# EAGLE design psiboard (EAGLE 9.1.1)
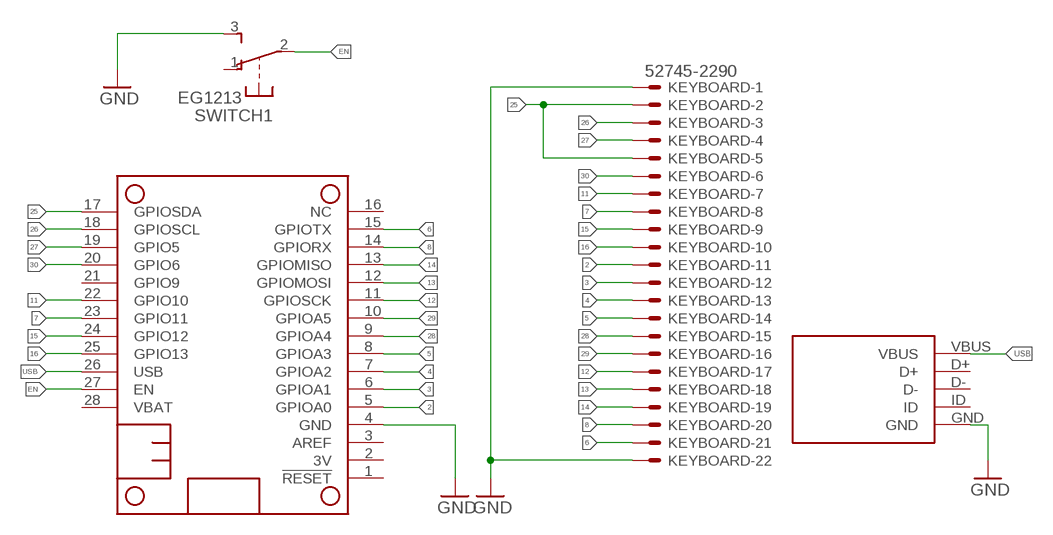
[diagram p0: schematic, sheet 1]

## Parts
FEATHER  FEATHERWING_NODIM  [FEATHERWING_DIM]
KEYBOARD  52745-2290  [52745-2290]
SWITCH  EG1213  [EG1213]
U$2  USB_MICRO_PWR  [MICROBUILDER_4UCONN_20329]

## Nets
2: FEATHER.5(GPIOA0) KEYBOARD.11
3: FEATHER.6(GPIOA1) KEYBOARD.12
4: FEATHER.7(GPIOA2) KEYBOARD.13
5: FEATHER.8(GPIOA3) KEYBOARD.14
6: FEATHER.15(GPIOTX) KEYBOARD.21
7: FEATHER.23(GPIO11) KEYBOARD.8
8: FEATHER.14(GPIORX) KEYBOARD.20
11: FEATHER.22(GPIO10) KEYBOARD.7
12: FEATHER.11(GPIOSCK) KEYBOARD.17
13: FEATHER.12(GPIOMOSI) KEYBOARD.18
14: FEATHER.13(GPIOMISO) KEYBOARD.19
15: FEATHER.24(GPIO12) KEYBOARD.9
16: FEATHER.25(GPIO13) KEYBOARD.10
25: FEATHER.17(GPIOSDA) KEYBOARD.2 KEYBOARD.5
26: FEATHER.18(GPIOSCL) KEYBOARD.3
27: FEATHER.19(GPIO5) KEYBOARD.4
28: FEATHER.9(GPIOA4) KEYBOARD.15
29: FEATHER.10(GPIOA5) KEYBOARD.16
30: FEATHER.20(GPIO6) KEYBOARD.6
EN: FEATHER.27(EN) SWITCH.2(1:P)
GND: FEATHER.4(GND) KEYBOARD.1 KEYBOARD.22 SWITCH.3(1:S) U$2.GND
USB: FEATHER.26(USB) U$2.VBUS
Unconnected: FEATHER.1(!RESET) FEATHER.2(3V) FEATHER.3(AREF) FEATHER.16(NC) FEATHER.21(GPIO9) FEATHER.28(VBAT) SWITCH.1(1:O) SWITCH.MT1(MT) SWITCH.MT2(MT) U$2.D+ U$2.D- U$2.ID

## Library data of the parts
FEATHER = adafruit:FEATHERWING
KEYBOARD = con-molex:52745-2290: FFC/FPC-to-Board 0.50mm (.020") SMT Top Contact Right Angle, ZIF, Style Receptacle 52745 / 52435 Source: http://www.molex.com/product/ffc/52745.html; MF: MOLEX; OC_FARNELL: unknown; OC_NEWARK: unknown
SWITCH = adafruit:EG1213: E-Switch right-angle slide SPDT Part #EG1213 http://www.ladyada.net/library/eagle
U$2 = microB:USB_MICRO_PWR

## Board
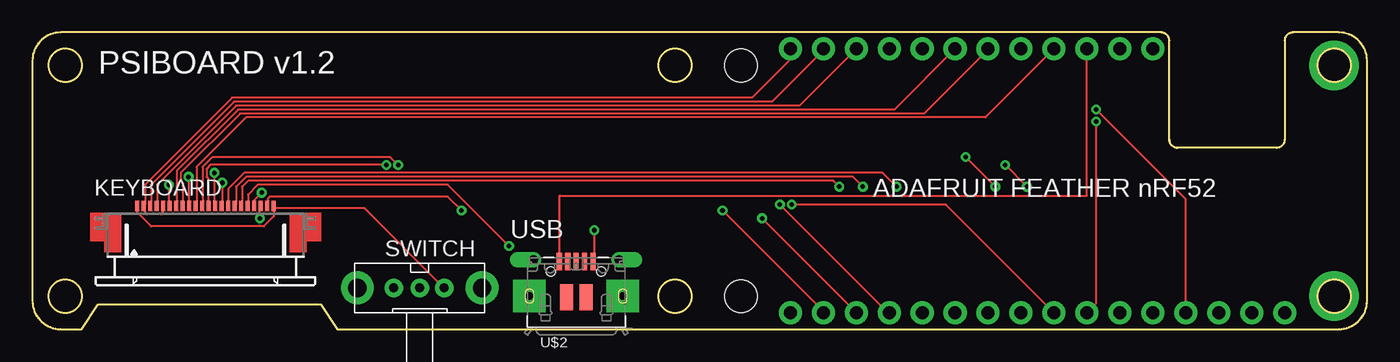
[diagram p1: board, top side]
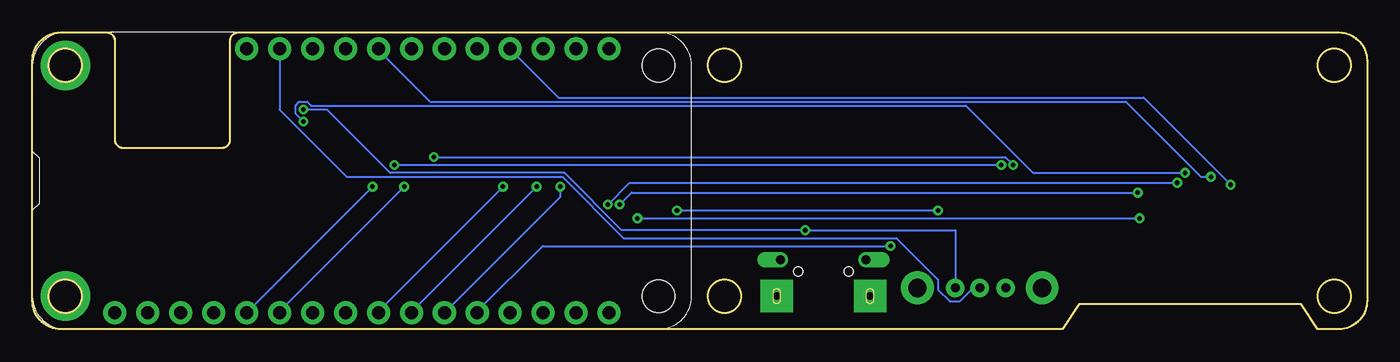
[diagram p2: board, bottom side, seen from below]

Size 102.87 x 22.86 mm. Coordinates in mm from the lower left corner, seen from the top.
Outline: 0,20.69 0,2.17 arc90 2.17,0 3.81,0 5.08,1.91 22.23,1.91 23.5,0 100.7,0 arc90 102.87,2.17 102.87,20.69 arc90 100.7,22.86 97.16,22.86 arc90 96.52,22.23 96.52,14.61 arc-90 95.89,13.97 88.27,13.97 arc-90 87.63,14.61 87.63,22.23 arc90 87,22.86 2.17,22.86 arc90 0,20.69
Outline: circle at 2.54,20.32 radius 1.27
Outline: circle at 2.54,2.54 radius 1.27
Outline: circle at 49.53,20.32 radius 1.27
Outline: circle at 49.53,2.54 radius 1.27
Outline: circle at 100.33,20.32 radius 1.27
Outline: circle at 100.33,2.54 radius 1.27
Copper layers (1*16): Top 0.035mm / dielectric 1.5mm / Bottom 0.035mm
Design rules "default": minimum track width 6mil, minimum drill 0.35mm, track to track 6mil, track to pad 6mil, pad to pad 6mil, via to via 6mil, smd to smd 6mil, copper to edge 40mil, drill to drill 6mil, minimum pad ring 10mil, minimum via ring 8mil, stop-mask expansion 4mil, vias tented up to drill 0mil, thermal gap 10mil
Holes 2.54 mm at 2.54,2.54 2.54,20.32 49.53,2.54 49.53,20.32

### Footprints (pad centres in the part's own frame; a part is rotated, then mirrored left to right if it is on the bottom)
FEATHERWING_DIM = drill 1 pad 1.778: 1 6.35,1.27; 2 8.89,1.27; 3 11.43,1.27; 4 13.97,1.27; 5 16.51,1.27; 6 19.05,1.27; 7 21.59,1.27; 8 24.13,1.27; 9 26.67,1.27; 10 29.21,1.27; 11 31.75,1.27; 12 34.29,1.27; 13 36.83,1.27; 14 39.37,1.27; 15 41.91,1.27; 16 44.45,1.27; 17 44.45,21.59; 18 41.91,21.59; 19 39.37,21.59; 20 36.83,21.59; 21 34.29,21.59; 22 31.75,21.59; 23 29.21,21.59; 24 26.67,21.59; 25 24.13,21.59; 26 21.59,21.59; 27 19.05,21.59; 28 16.51,21.59 | drill 2.5 pad 3.81: P$1 2.54,20.32; P$2 2.54,2.54 | hole 2.54: 48.26,20.32; 48.26,2.54
52745-2290 = smd 0.3 x 0.8: 1 -5.25,2.5; 2 -4.75,2.5; 3 -4.25,2.5; 4 -3.75,2.5; 5 -3.25,2.5; 6 -2.75,2.5; 7 -2.25,2.5; 8 -1.75,2.5; 9 -1.25,2.5; 10 -0.75,2.5; 11 -0.25,2.5; 12 0.25,2.5; 13 0.75,2.5; 14 1.25,2.5; 15 1.75,2.5; 16 2.25,2.5; 17 2.75,2.5; 18 3.25,2.5; 19 3.75,2.5; 20 4.25,2.5; 21 4.75,2.5; 22 5.25,2.5
EG1213 = drill 0.7 pad 1.422: 1 -2,0; 2 0,0; 3 1.9,0 | drill 1.4 pad 2.54: MT1 -4.8,0; MT2 4.8,0
MICROBUILDER_4UCONN_20329 = smd 1 x 2: BASE@1 -0.75,-2; BASE@2 0.75,-2 | smd 0.4 x 1.35: D+ 0,0.775; D- -0.65,0.775; GND 1.3,0.775; ID 0.65,0.775; VBUS -1.3,0.775 | drill 0.7 offset: SPRT@1 -3.3,0.9; SPRT@2 3.3,0.9 | drill 0.6 pad 2.5 square: SPRT@3 -3.6,-1.9; SPRT@4 3.6,-1.9 | hole 0.7: -1.95,0; 1.95,0

### Placement (x,y rotation side)
FEATHER  102.87,0 0 bottom
KEYBOARD  13.34,6.99 0 top
SWITCH  29.84,3.17 0 top
U$2  41.91,4.45 0 top

### Tracks (layer width: path | path; a pad name or v marks a point on that pad's centre or on a via)
2  (via drill 0.35)
  Top 0.152: v28.19,12.65 27.58,13.26 13.87,13.26 13.11,12.5 13.11,9.6 KEYBOARD.11 | v76.66,10.97 v74.98,12.65
  Bottom 0.152: v74.98,12.65 v28.19,12.65 | FEATHER.5 v76.66,10.97
3  (via drill 0.35)
  Top 0.152: v27.28,12.65 13.72,12.65 13.41,12.34 13.41,11.73 13.56,11.58 13.56,9.6 KEYBOARD.12 | v74.22,10.97 v71.93,13.26
  Bottom 0.152: v27.28,12.65 27.89,13.26 v71.93,13.26 | v74.22,10.97 83.82,1.37 FEATHER.6
4  (via drill 0.35)
  Top 0.152: v14.02,12.04 14.02,9.6 KEYBOARD.13 | v81.99,16 81.99,1.98 FEATHER.7
  Bottom 0.152: v14.02,12.04 25.76,12.04 30.94,17.22 81.38,17.22 81.69,17.53 82.3,17.53 82.6,17.22 82.6,16.61 v81.99,16
5  (via drill 0.35)
  Top 0.152: v14.63,11.28 14.63,9.6 KEYBOARD.14 | v58.52,9.6 70.41,9.6 FEATHER.8
  Bottom 0.152: v14.63,11.28 56.84,11.28 v58.52,9.6
6  (via drill 0.35)
  Top 0.152: v33.07,9.14 32,10.21 18.29,10.21 18.14,10.06 18.14,9.6 KEYBOARD.21 | v53.19,9.14 60.96,1.37 FEATHER.15
  Bottom 0.152: v53.19,9.14 v33.07,9.14
7
  Top 0.152: KEYBOARD.8 11.58,9.6 11.58,11.28 11.43,11.43 11.43,12.04 16,16.61 68.73,16.61 73.61,21.49 FEATHER.23
8  (via drill 0.35)
  Top 0.152: v17.53,8.53 17.53,9.45 KEYBOARD.20 | FEATHER.14 v56.24,8.53
  Bottom 0.152: v56.24,8.53 v17.53,8.53
11
  Top 0.152: FEATHER.22 66.45,16.92 15.85,16.92 11.12,12.19 11.12,9.6 KEYBOARD.7
12  (via drill 0.35)
  Top 0.152: v62.18,10.97 61.72,11.43 16.61,11.43 16.15,10.97 16.15,9.6 KEYBOARD.17
  Bottom 0.152: v62.18,10.97 62.18,10.21 FEATHER.11
13  (via drill 0.35)
  Top 0.152: v36.73,6.4 32,11.12 17.37,11.12 16.61,10.36 16.61,9.6 KEYBOARD.18
  Bottom 0.152: v36.73,6.4 63.55,6.4 68.58,1.37 FEATHER.12
14  (via drill 0.35)
  Top 0.152: v17.68,10.52 17.07,9.91 17.07,9.6 KEYBOARD.19 | v57.61,9.6 65.99,1.22 FEATHER.13
  Bottom 0.152: v17.68,10.52 56.69,10.52 v57.61,9.6
15  (via drill 0.35)
  Top 0.152: v12.04,11.73 12.04,9.6 KEYBOARD.9
  Bottom 0.152: v12.04,11.73 12.8,11.73 18.59,17.53 72.24,17.53 76.2,21.49 FEATHER.24
16
  Top 0.152: FEATHER.25 73.46,16.31 16.46,16.31 12.65,12.5 12.65,9.6 KEYBOARD.10
25
  Top 0.152: KEYBOARD.5 10.06,9.45 10.06,8.99 9.91,8.84 8.84,8.84 8.69,8.99 8.69,9.45 KEYBOARD.2 8.69,9.6 8.69,11.12 15.39,17.83 55.47,17.83 58.37,20.73 58.37,21.49 FEATHER.17
26
  Top 0.152: KEYBOARD.3 9.14,9.6 9.14,11.12 15.54,17.53 57,17.53 60.96,21.49 FEATHER.18
27
  Top 0.152: FEATHER.19 59.13,17.22 15.7,17.22 9.6,11.12 9.6,9.6 KEYBOARD.4
28  (via drill 0.35)
  Top 0.152: v66.6,10.97 65.53,12.04 16.31,12.04 15.09,10.82 15.09,9.6 KEYBOARD.15
  Bottom 0.152: v66.6,10.97 76.2,1.37 FEATHER.9
29  (via drill 0.35)
  Top 0.152: v64.01,10.97 63.25,11.73 16.46,11.73 15.7,10.97 15.7,9.6 KEYBOARD.16
  Bottom 0.152: v64.01,10.97 73.61,1.37 FEATHER.10
30  (via drill 0.35)
  Top 0.152: v10.52,11.12 10.52,9.6 KEYBOARD.6
  Bottom 0.152: v10.52,11.12 17.22,17.83 62.33,17.83 65.99,21.49 FEATHER.20
EN
  Bottom 0.152: FEATHER.27 83.82,16.92 78.64,11.73 62.03,11.73 57.3,7.01 36.27,7.01 33.07,3.81 33.07,3.05 32.16,2.13 31.39,2.13 30.48,3.05 29.87,3.05 SWITCH.2
GND  (via drill 0.35)
  Top 0.152: U$2.GND 43.31,5.32 v43.31,7.62 | 18.59,9.3 18.59,9.45 KEYBOARD.22 18.59,9.3 | 18.59,9.3 18.59,8.69 17.83,7.92 9.14,7.92 8.08,8.99 8.08,9.45 KEYBOARD.1 | v81.99,16.92 88.85,10.06 88.85,1.37 FEATHER.4 | 18.59,9.3 25.6,9.3 31.7,3.2 SWITCH.3
  Bottom 0.152: SWITCH.3 31.75,7.62 v43.31,7.62 57.45,7.62 61.87,12.04 75.29,12.04 80.16,16.92 v81.99,16.92
USB
  Top 0.152: U$2.VBUS 40.61,10.26 40.64,10.29 81.28,10.29 FEATHER.26

### Text on the board
tPlace: PSIBOARD v1.2 | ADAFRUIT FEATHER nRF52 | USB